# EAGLE design side_wide (EAGLE 9.3.0)
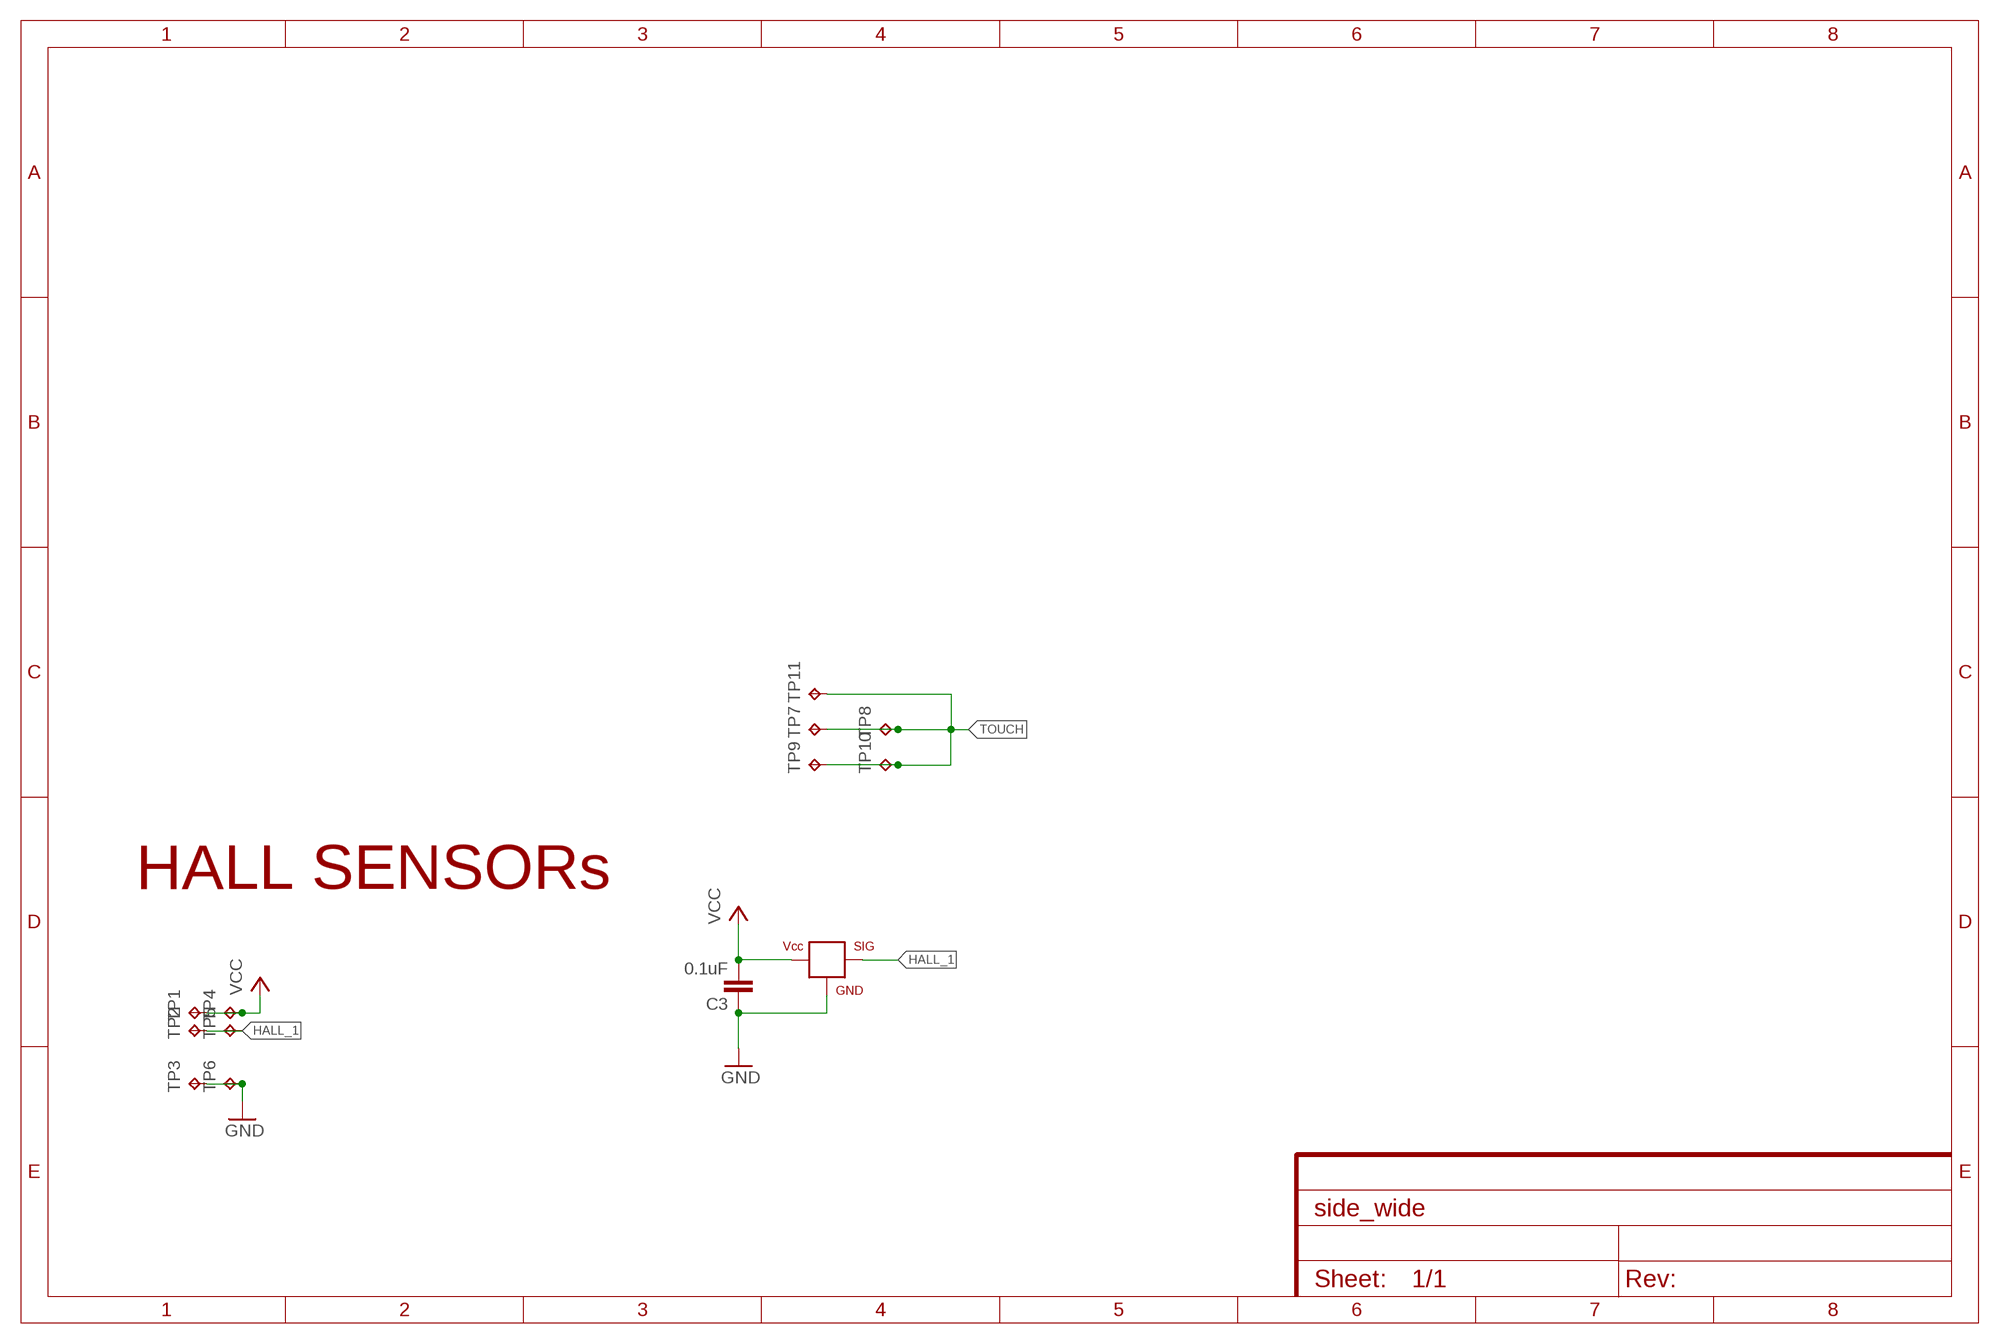
[diagram p0: schematic, sheet 1]

## Parts
C3  0.1uF  CAP0603-CAP  [0603-CAP]
HALL  HALLEFFECT-A1326  [SOT23-3]
TP1  TPTP10SQ  [TP10SQ]
TP2  TPTP10SQ  [TP10SQ]
TP3  TPTP10SQ  [TP10SQ]
TP4  TPTP10SQ  [TP10SQ]
TP5  TPTP10SQ  [TP10SQ]
TP6  TPTP10SQ  [TP10SQ]
TP7  TPTP10SQ  [TP10SQ]
TP8  TPTP10SQ  [TP10SQ]
TP9  TPTP10SQ  [TP10SQ]
TP10  TPTP10SQ  [TP10SQ]
TP11  TPTP10SQ  [TP10SQ]

## Nets
GND: C3.1 HALL.3(GND) TP3.TP TP6.TP
HALL_1: HALL.2(SIG) TP2.TP TP5.TP
TOUCH: TP7.TP TP8.TP TP9.TP TP10.TP TP11.TP
VCC: C3.2 HALL.1(VCC) TP1.TP TP4.TP

## Notes on the sheet
- HALL SENSORs

## Library data of the parts
C3 = SparkFun:CAP: Capacitor Standard 0603 ceramic capacitor, and 0.1" leaded capacitor.
HALL = Andy_Sigler:HALLEFFECT-A1326
TP1-TP11 = testpad:TP: Test pad

## Board
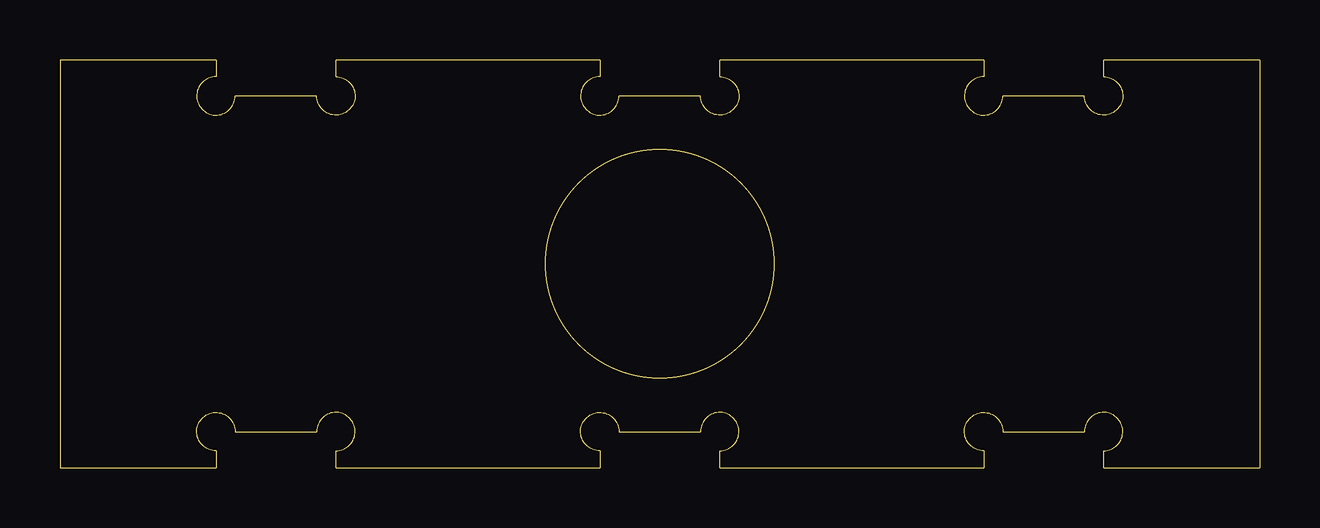
[diagram p1: board, top side]
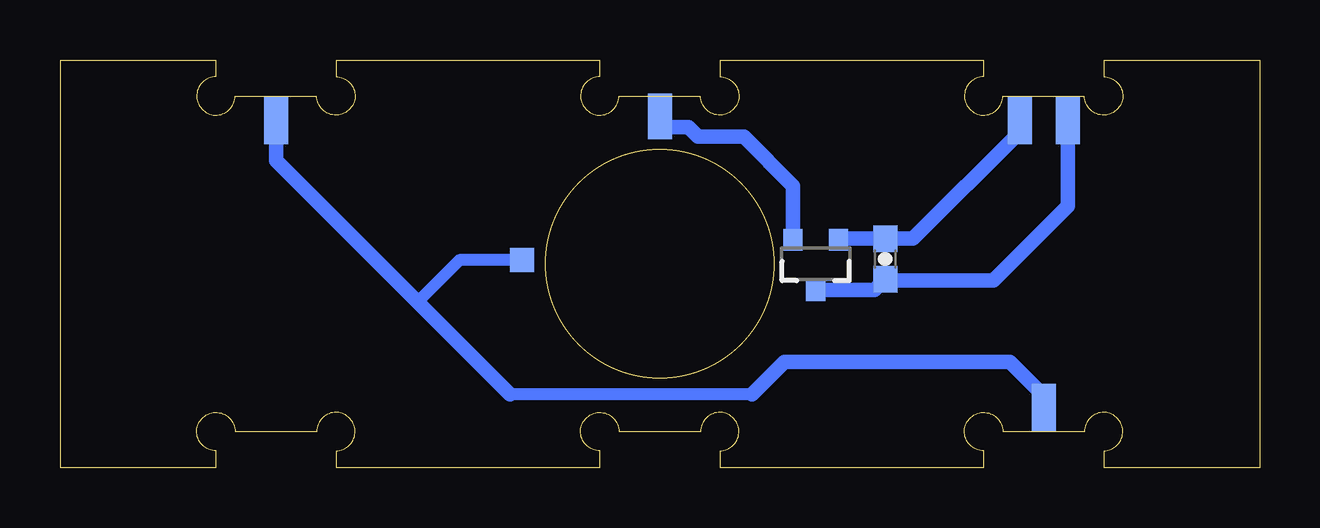
[diagram p2: board, bottom side, seen from below]

Size 50 x 17 mm. Coordinates in mm from the lower left corner, seen from the top.
Outline: 0,17 0,0 6.5,0 6.5,0.7 arc-270 7.3,1.5 10.7,1.5 arc-270 11.5,0.7 11.5,0 22.5,0 22.5,0.7 arc-270 23.3,1.5 26.7,1.5 arc-270 27.5,0.7 27.5,0 38.5,0 38.5,0.7 arc-270 39.3,1.5 42.7,1.5 arc-270 43.5,0.7 43.5,0 50,0 50,17 43.5,17 43.5,16.3 arc-270 42.7,15.5 39.3,15.5 arc-270 38.5,16.3 38.5,17 27.5,17 27.5,16.3 arc-270 26.7,15.5 23.3,15.5 arc-270 22.5,16.3 22.5,17 11.5,17 11.5,16.3 arc-270 10.7,15.5 7.3,15.5 arc-270 6.5,16.3 6.5,17 0,17
Outline: circle at 25,8.5 radius 4.76
Copper layers (1*16): Top 0.0356mm / dielectric 1.5011mm / Bottom 0.0356mm
Design rules "LaenPCBOrder *": minimum track width 6mil, minimum drill 13mil, track to track 6mil, track to pad 6mil, pad to pad 6mil, via to via 6mil, smd to smd 6mil, copper to edge 15mil, drill to drill 6mil, minimum pad ring 7mil, minimum via ring 7mil, stop-mask expansion 3mil, vias tented up to drill 20mil, thermal gap 10mil

### Footprints (pad centres in the part's own frame; a part is rotated, then mirrored left to right if it is on the bottom)
0603-CAP = smd 1.1 x 1: 1 -0.85,0; 2 0.85,0
SOT23-3 = smd 0.8 x 0.9: 1 -0.95,-1; 2 0.95,-1; 3 0,1.1
TP10SQ = smd 1 x 1: TP 0,0

### Placement (x,y rotation side)
C3  15.6,8.7 90 bottom
HALL  18.5,8.5 180 bottom
TP1  10,14 90 bottom
TP2  25,14.2 90 bottom
TP3  8,15 90 bottom
TP4  10,15 90 bottom
TP5  25,15.1 90 bottom
TP6  8,14 90 bottom
TP7  9,3 0 bottom
TP8  9,2 0 bottom
TP9  41,14 0 bottom
TP10  41,15 0 bottom
TP11  30.75,8.65 0 bottom

### Tracks (layer width: path | path; a pad name or v marks a point on that pad's centre or on a via)
GND
  Bottom 0.508: TP3.TP TP6.TP
  Bottom 0.61: TP6.TP 8,10.9 11.1,7.8 15.55,7.8 C3.1 16.05,7.4 HALL.3
HALL_1
  Bottom 0.508: TP5.TP TP2.TP
  Bottom 0.61: TP2.TP 23.8,14.2 23.4,13.8 21.5,13.8 19.45,11.75 HALL.2
TOUCH
  Bottom 0.508: 21.15,3.05 31.25,3.05 | TP11.TP 33.35,8.65 35.1,6.9
  Bottom 0.61: TP8.TP TP7.TP 10.4,4.4 19.8,4.4 21.15,3.05 | TP10.TP TP9.TP 41,12.8 35.1,6.9 31.25,3.05
VCC
  Bottom 0.508: TP4.TP TP1.TP
  Bottom 0.61: TP1.TP 14.45,9.55 C3.2 17.5,9.55 HALL.1